# Altium project 555-Indicator.PrjPcb
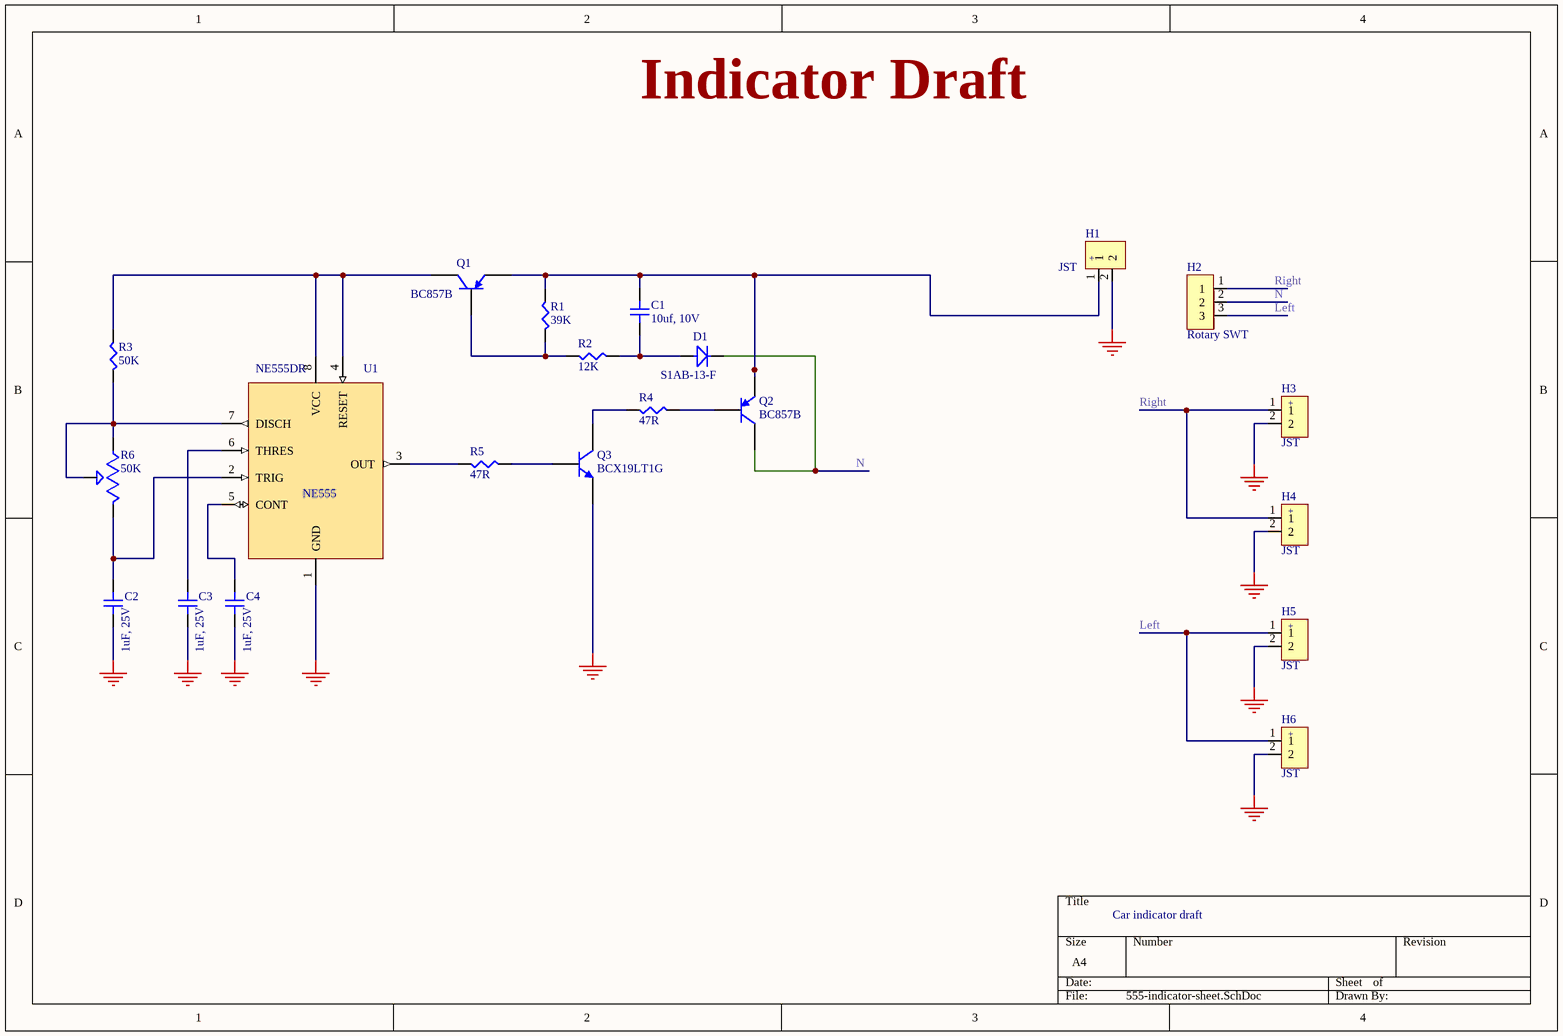
[diagram p0: 555-indicator-sheet.SchDoc]
1 sheet, 21 parts. Net scope: global (net labels, ports and power ports of the same name join across sheets).
Board file: 555-indicator-PCB.PcbDoc

## Sheet 555-indicator-sheet.SchDoc
size A4; SheetNumber: 1; SheetTotal: 1

### Parts
C1  10uf, 10V  [CAPC2012X140N]
C2  1uF, 25V  [CAPC2012X140N]
C3  1uF, 25V  [CAPC2012X140N]
C4  1uF, 25V  [CAPC2012X140N]
D1  S1AB-13-F  [FP-SMB-MFG]
H1  JST  [FP-B2B-XH-A_LF_SN-MFG]
H2  Rotary SWT  [JST_B3B-XH-A]
H3  JST  [FP-B2B-XH-A_LF_SN-MFG]
H4  JST  [FP-B2B-XH-A_LF_SN-MFG]
H5  JST  [FP-B2B-XH-A_LF_SN-MFG]
H6  JST  [FP-B2B-XH-A_LF_SN-MFG]
Q1  BC857B  [PNP_BC857B,235]
Q2  BC857B  [PNP_BC857B,235]
Q3  BCX19LT1G  [NPN_BCX19LT1G]
R1  39K  [RESC3116X65N]
R2  12K  [RESC3116X65N]
R3  50K  [RESC3116X65N]
R4  47R  [RESC3116X65N]
R5  47R  [RESC3116X65N]
R6  50K  [TRIM_3266W-1-503LF]
U1  NE555DR  [FP-D0008A-MFG]

### Nets
GND: C2.2 C3.2 C4.2 H1.2 H3.2 H4.2 H5.2 H6.2 Q3.2(E) U1.1(GND)
Left: H2.3 H5.1 H6.1
N: D1.2 H2.2 Q2.3(C)
Right: H2.1 H3.1 H4.1
NetC1_1: C1.1 D1.1 R2.2
NetC1_2: C1.2 H1.1 Q1.2(E) Q2.2(E) R1.1
NetC2_1: C2.1 R6.3(CW) U1.2(TRIG)
NetC3_1: C3.1 U1.6(THRES)
NetC4_1: C4.1 U1.5(CONT)
NetQ1_1: Q1.1(B) R1.2 R2.1
NetQ1_3: Q1.3(C) R3.1 U1.4(RESET) U1.8(VCC)
NetQ2_1: Q2.1(B) R4.2
NetQ3_1: Q3.1(B) R5.2
NetQ3_3: Q3.3(C) R4.1
NetR3_2: R3.2 R6.1(CCW) R6.2(WIPER) U1.7(DISCH)
NetR5_1: R5.1 U1.3(OUT)

### Notes on the sheet
- Indicator Draft
- Car indicator draft
- (in symbol B2B-XH-A(LF)(SN)) +
- (in symbol NE555DR) NE555

### Library data of the parts
C1 = CL21A106KPFNNNE: CAP CER 10UF 10V X5R 0805; Manufacturer: Samsung; Dielectric Material: Ceramic; Multilayer: Yes; Tolerance  (fill in as +-): 10%; Supplier: Digikey; Supplier Part Number: 1276-1052-6-ND; Manufacturer Part Number: CL21A106KPFNNNE; Category: Ceramic Capacitors; Stock: 539282; Pricing: 1=0.1, 10=0.054, 50=0.0374, 100=0.0322, 500=0.02334, 1000=0.0206 (USD); Mounting Technology: Surface Mount; Pins: 2; Package Shape: Rectangular; Case/Package: 0805; Terminal Finish: Nickel; Min Operating Temperature: -55°C; Max Operating Temperature: 85°C; JESD-609 Code: e3; Value: 10uF; Capacitor Type: Ceramic; Package Style: SMTMeter; Packaging: Tape and Reel; Tolerance (fill in as +-): 10%; Rated DC Voltage (URdc): 10V; Temperature Characteristics Code: X5R; Termination: Wraparound; Length: 2mm; Width: 1.25mm; Height: 1.35mm; Reach SVHC Compliant: Yes; RoHS Compliant: Yes; ComponentLink1URL: https://datasheet.ciiva.com:443/pdfs/VipMasterIC/IC/SEMS/SEMS-S-A0008526420/SEMS-S-A0008526398-1.pdf?src-supplier=IHS+Markit; ComponentLink1Description: https://datasheet.ciiva.com:443/pdfs/VipMasterIC/IC/SEMS/SEMS-S-A0008526420/SEMS-S-A0008526398-1.pdf?src-supplier=IHS+Markit; ComponentLink2URL: https://datasheet.ciiva.com/16199/cl05b104kq5nnnc-16199024.pdf?src-supplier=Future+Electronics; ComponentLink2Description: https://datasheet.ciiva.com/16199/cl05b104kq5nnnc-16199024.pdf?src-supplier=Future+Electronics; ComponentLink3URL: https://datasheet.ciiva.com/15195/getdatasheetpartid-357423-15195857.pdf?src-supplier=Verical; ComponentLink3Description: https://datasheet.ciiva.com/15195/getdatasheetpartid-357423-15195857.pdf?src-supplier=Verical; ComponentLink4URL: https://datasheet.octopart.com/CL21A106KPFNNNE-Samsung-Electro-Mechanics-datasheet-136031801.pdf?src-supplier=Farnell; ComponentLink4Description: https://datasheet.octopart.com/CL21A106KPFNNNE-Samsung-Electro-Mechanics-datasheet-136031801.pdf?src-supplier=Farnell; ComponentLink5URL: https://datasheet.octopart.com/CL21A106KPFNNNE-Samsung-Electro-Mechanics-datasheet-8324245.pdf; ComponentLink5Description: https://datasheet.octopart.com/CL21A106KPFNNNE-Samsung-Electro-Mechanics-datasheet-8324245.pdf; ComponentLink6URL: https://datasheet.octopart.com/CL21A106KPFNNNE-Samsung-Electro-Mechanics-datasheet-97040617.pdf; ComponentLink6Description: https://datasheet.octopart.com/CL21A106KPFNNNE-Samsung-Electro-Mechanics-datasheet-97040617.pdf; ComponentLink7URL: https://datasheet.octopart.com/General-Multilayer-Ceramic-Capacitors-Samsung-datasheet-family-111.pdf; ComponentLink7Description: https://datasheet.octopart.com/General-Multilayer-Ceramic-Capacitors-Samsung-datasheet-family-111.pdf; ComponentLink8URL: https://datasheet.octopart.com/CL21A106KPFNNNE-Samsung-Electro-Mechanics-datasheet-110326887.pdf?src-supplier=Future+Electronics; ComponentLink8Description: https://datasheet.octopart.com/CL21A106KPFNNNE-Samsung-Electro-Mechanics-datasheet-110326887.pdf?src-supplier=Future+Electronics; ComponentLink9URL: https://datasheet.octopart.com/CL21A106KPFNNNE-Samsung-Electro-Mechanics-datasheet-81462124.pdf?src-supplier=Future+Electronics; ComponentLink9Description: https://datasheet.octopart.com/CL21A106KPFNNNE-Samsung-Electro-Mechanics-datasheet-81462124.pdf?src-supplier=Future+Electronics; ComponentLink10URL: https://datasheet.octopart.com/CL21A106KPFNNNE-Samsung-datasheet-48647544.pdf?src-supplier=Future+Electronics; ComponentLink10Description: https://datasheet.octopart.com/CL21A106KPFNNNE-Samsung-datasheet-48647544.pdf?src-supplier=Future+Electronics; ComponentLink11URL: https://datasheet.octopart.com/CL21A106KPFNNNE-Samsung-datasheet-26669229.pdf?src-supplier=Future+Electronics; ComponentLink11Description: https://datasheet.octopart.com/CL21A106KPFNNNE-Samsung-datasheet-26669229.pdf?src-supplier=Future+Electronics; ComponentLink12URL: https://datasheet.octopart.com/CL21A106KPFNNNE-Samsung-datasheet-22147434.pdf?src-supplier=TME; ComponentLink12Description: https://datasheet.octopart.com/CL21A106KPFNNNE-Samsung-datasheet-22147434.pdf?src-supplier=TME; ComponentLink13URL: https://datasheet.octopart.com/CL21A106KPFNNNE-Samsung-Electro-Mechanics-datasheet-11781485.pdf?src-supplier=Arrow+Electronics; ComponentLink13Description: https://datasheet.octopart.com/CL21A106KPFNNNE-Samsung-Electro-Mechanics-datasheet-11781485.pdf?src-supplier=Arrow+Electronics; LCSC part no: C17024
C2-C4 = CL21B105KAFNNNE: CAP CER 1UF 25V X7R 0805; Manufacturer: Samsung; Dielectric Material: Ceramic; Multilayer: Yes; Tolerance  (fill in as +-): 10%; Supplier: Digikey; Supplier Part Number: 1276-1066-6-ND; Manufacturer Part Number: CL21B105KAFNNNE; RoHS: Yes; Category: Ceramic Capacitors; Stock: 1459194; Pricing: 1=0.08, 10=0.027, 50=0.022, 100=0.0168, 500=0.0152, 1000=0.0136 (USD); Mounting Technology: Surface Mount; Pins: 2; Package Shape: Rectangular; Case/Package: 0805; Terminal Finish: Nickel; Min Operating Temperature: -55°C; Max Operating Temperature: 125°C; JESD-609 Code: e3; Value: 1uF; Capacitor Type: Ceramic; Package Style: SMTMeter; Packaging: Tape and Reel; Tolerance (fill in as +-): 10%; Rated DC Voltage (URdc): 25V; Temperature Characteristics Code: X7R; Termination: Wraparound; Length: 2mm; Width: 1.25mm; Height: 1.35mm; Reach SVHC Compliant: Yes; RoHS Compliant: Yes; ComponentLink1URL: https://datasheet.ciiva.com:443/pdfs/VipMasterIC/IC/SEMS/SEMS-S-A0008523501/SEMS-S-A0008523563-1.pdf?src-supplier=IHS+Markit; ComponentLink1Description: https://datasheet.ciiva.com:443/pdfs/VipMasterIC/IC/SEMS/SEMS-S-A0008523501/SEMS-S-A0008523563-1.pdf?src-supplier=IHS+Markit; ComponentLink2URL: https://datasheet.ciiva.com/25800/cl21b105kafnnne-25800163.pdf?src-supplier=Digikey; ComponentLink2Description: https://datasheet.ciiva.com/25800/cl21b105kafnnne-25800163.pdf?src-supplier=Digikey; ComponentLink3URL: https://datasheet.ciiva.com/15195/getdatasheetpartid-355205-15195880.pdf?src-supplier=Verical; ComponentLink3Description: https://datasheet.ciiva.com/15195/getdatasheetpartid-355205-15195880.pdf?src-supplier=Verical; LCSC part no: C116352
D1 = S1AB-13-F: DIODE GEN PURP 50V 1A DO214AC; Manufacturer: Diodes; Package Body Material: Plastic; Diode Element Material: SILICON; Diode Type: RECTIFIER; Forward Voltage: 1.1V; Non-rep Pk Forward Current-Max: 30A; Number of Elements: 1; Reverse Recovery Time-Max: 3us; Time @ Peak Reflow Temperature-Max (s): 40s; Additional Feature: HIGH RELIABILITY; Qualification Status: Not Qualified; Supplier: Digikey; Supplier Part Number: S1AB-FDICT-ND; Manufacturer Part Number: S1AB-13-F; RoHS: Yes; Category: Rectifier Diodes; Stock: 182225; Pricing: 1=0.18, 10=0.121, 100=0.0813, 500=0.06208, 1000=0.05559 (USD); Pins: 2; Package Shape: Rectangular; Terminal Finish: Tin; Min Operating Temperature: -65°C; Max Operating Temperature: 150°C; Package Style: SMALL OUTLINEMeter; JESD-609 Code: e3; JESD-30 Code: R-PDSO-C2; Surface Mount: Yes; Terminal Form: C BEND; Terminal Position: DUAL; Moisture Sensitivity Level: 1; Max Output current: 1A; Peak Reflow Temperature (Cel): 260°C; Rep Pk Reverse Voltage-Max: 50V; RoHS Compliant: Yes; Reach SVHC Compliant: No; ComponentLink1URL: https://datasheet.ciiva.com:443/pdfs/VipMasterIC/IC/DIOD/DIOD-S-A0007810797/DIOD-S-A0007810797-1.pdf?src-supplier=IHS+Markit; ComponentLink1Description: https://datasheet.ciiva.com:443/pdfs/VipMasterIC/IC/DIOD/DIOD-S-A0007810797/DIOD-S-A0007810797-1.pdf?src-supplier=IHS+Markit; LCSC part no: C519094
H1 H3-H6 = B2B-XH-A(LF)(SN): CONN HEADER VERT 2POS 2.5MM; Supplier: Future Electronics; Supplier Part Number: 1638840; Manufacturer: JST; Manufacturer Part Number: B2B-XH-A(LF)(SN); RoHS: Yes; Category: Headers and Wire Housings; Stock: 668373; Pricing: 1=0.0563, 750=0.0541, 2500=0.0518, 7500=0.0498, 25000=0.0458 (USD); ComponentLink1URL: https://datasheet.ciiva.com/11746/0900766b8082653e-11746979.pdf?src-supplier=Rs; ComponentLink1Description: https://datasheet.ciiva.com/11746/0900766b8082653e-11746979.pdf?src-supplier=Rs; ComponentLink2URL: https://datasheet.ciiva.com/26894/getdatasheetpartid-640357-26894434.pdf?src-supplier=Verical; ComponentLink2Description: https://datasheet.ciiva.com/26894/getdatasheetpartid-640357-26894434.pdf?src-supplier=Verical; ComponentLink3URL: https://datasheet.ciiva.com/26894/getdatasheetpartid-385291-26894760.pdf?src-supplier=Verical; ComponentLink3Description: https://datasheet.ciiva.com/26894/getdatasheetpartid-385291-26894760.pdf?src-supplier=Verical; ComponentLink4URL: https://datasheet.ciiva.com/8052/5448-8052024.pdf?src-supplier=Element14; ComponentLink4Description: https://datasheet.ciiva.com/8052/5448-8052024.pdf?src-supplier=Element14; LCSC part no: C158012
H2 = B3B-XH-A(LF)(SN): CONN HEADER VERT 3POS 2.5MM; Manufacturer: JST; Supplier: Future Electronics; Supplier Part Number: 8262735; Manufacturer Part Number: B3B-XH-A(LF)(SN); RoHS: Yes; Category: Headers and Wire Housings; Stock: 57931; Pricing: 1=0.0792, 500=0.0757, 1500=0.0727, 5000=0.0695, 15000=0.0637 (USD); ComponentLink1URL: https://datasheet.ciiva.com/11746/0900766b8082653f-11746520.pdf?src-supplier=Rs; ComponentLink1Description: https://datasheet.ciiva.com/11746/0900766b8082653f-11746520.pdf?src-supplier=Rs; ComponentLink2URL: https://datasheet.ciiva.com/26894/getdatasheetpartid-640434-26894454.pdf?src-supplier=Verical; ComponentLink2Description: https://datasheet.ciiva.com/26894/getdatasheetpartid-640434-26894454.pdf?src-supplier=Verical; ComponentLink3URL: https://datasheet.ciiva.com/26894/getdatasheetpartid-440399-26894778.pdf?src-supplier=Verical; ComponentLink3Description: https://datasheet.ciiva.com/26894/getdatasheetpartid-440399-26894778.pdf?src-supplier=Verical; LCSC part no: C144394
Q1 Q2 = BC857B: BJT SOT-23 45V 100MA; Manufacturer: Infineon; Supplier: Digikey; Supplier Part Number: BC857BE6327HTSA1CT-ND; Manufacturer Part Number: BC857B; RoHS: Yes; Stock: 18586; Pricing: 1=0.23, 10=0.14, 100=0.0872, 500=0.06382, 1000=0.05625 (USD); LCSC part no: C181146
Q3 = BCX19LT1G: TRANS NPN 45V 0.5A SOT23-3; Manufacturer: ON Semiconductor; Package Body Material: Plastic; Transistor Element Material: SILICON; Max Collector Current: 500mA; DC Current Gain-Min (hFE): 40; Number of Elements: 1; Time @ Peak Reflow Temperature-Max (s): 40s; Power Dissipation-Max (Abs): 225mW; Qualification Status: Not Qualified; JEDEC-95 Code: TO-236AB; Supplier: Digikey; Supplier Part Number: BCX19LT1GOSCT-ND; Manufacturer Part Number: BCX19LT1G; RoHS: Yes; Category: BJTs; Stock: 4512; Pricing: 1=0.12, 10=0.085, 100=0.0569, 500=0.04318, 1000=0.03851 (USD); Pins: 3; Package Shape: Rectangular; Terminal Finish: Tin; Max Operating Temperature: 150°C; Polarity/Channel Type: NPN; Moisture Sensitivity Level: 1; Surface Mount: Yes; JESD-609 Code: e3; Collector-emitter Voltage-Max: 45V; JESD-30 Code: R-PDSO-G3; Package Style: SMALL OUTLINEMeter; Terminal Form: Gull Wing; Terminal Position: DUAL; Peak Reflow Temperature (Cel): 260°C; RoHS Compliant: Yes; Reach SVHC Compliant: Yes; ComponentLink1URL: https://datasheet.ciiva.com:443/pdfs/VipMasterIC/IC/ONSM/ONSMS38866/ONSMS38866-1.pdf?src-supplier=IHS+Markit; ComponentLink1Description: https://datasheet.ciiva.com:443/pdfs/VipMasterIC/IC/ONSM/ONSMS38866/ONSMS38866-1.pdf?src-supplier=IHS+Markit; ComponentLink2URL: https://datasheet.ciiva.com/15138/getdatasheetpartid-38785-15138642.pdf?src-supplier=Verical; ComponentLink2Description: https://datasheet.ciiva.com/15138/getdatasheetpartid-38785-15138642.pdf?src-supplier=Verical; ComponentLink3URL: https://datasheet.ciiva.com/976/bcx17lt1-d-976538.pdf?src-supplier=Digikey; ComponentLink3Description: https://datasheet.ciiva.com/976/bcx17lt1-d-976538.pdf?src-supplier=Digikey; ComponentLink4URL: https://datasheet.ciiva.com/976/bcx17lt1-d-976539.pdf?src-supplier=Digikey; ComponentLink4Description: https://datasheet.ciiva.com/976/bcx17lt1-d-976539.pdf?src-supplier=Digikey; ComponentLink5URL: https://datasheet.ciiva.com/976/bcx17lt1-d-976540.pdf?src-supplier=Digikey; ComponentLink5Description: https://datasheet.ciiva.com/976/bcx17lt1-d-976540.pdf?src-supplier=Digikey; ComponentLink6URL: https://datasheet.ciiva.com/11204/bcx17lt1-d-11204428.pdf?src-supplier=Avnet; ComponentLink6Description: https://datasheet.ciiva.com/11204/bcx17lt1-d-11204428.pdf?src-supplier=Avnet; LCSC part no: C232541
R1 = ERJ-PB6B3902V: Res SMD 39K Ohm 0.1% 1/4W 0805; Manufacturer: Panasonic; Supplier: Digikey; Supplier Part Number: P20774CT-ND; Manufacturer Part Number: ERJ-PB6B3902V; RoHS: Yes; Category: Chip SMD Resistors; Stock: 9918; Pricing: 1=0.29, 10=0.161, 25=0.1292, 50=0.1098, 100=0.0939, 250=0.07684, 500=0.06644, 1000=0.05775 (USD); ComponentLink1URL: http://datasheet.octopart.com/ERJPB6B3902V-Panasonic-datasheet-82522998.pdf?src-supplier=Farnell; ComponentLink1Description: http://datasheet.octopart.com/ERJPB6B3902V-Panasonic-datasheet-82522998.pdf?src-supplier=Farnell; ComponentLink2URL: https://datasheet.octopart.com/ERJ-PB6B3902V-Panasonic-datasheet-82522998.pdf?src-supplier=Newark; ComponentLink2Description: https://datasheet.octopart.com/ERJ-PB6B3902V-Panasonic-datasheet-82522998.pdf?src-supplier=Newark; ComponentLink3URL: http://datasheet.octopart.com/ERJPB6B3902V-Panasonic-datasheet-82522998.pdf?src-supplier=Verical; ComponentLink3Description: http://datasheet.octopart.com/ERJPB6B3902V-Panasonic-datasheet-82522998.pdf?src-supplier=Verical; ComponentLink4URL: https://industrial.panasonic.com/cdbs/www-data/pdf/RDM0000/AOA0000C328.pdf?src-supplier=Digikey; ComponentLink4Description: https://industrial.panasonic.com/cdbs/www-data/pdf/RDM0000/AOA0000C328.pdf?src-supplier=Digikey; LCSC part no: C4158317
R2 = ERJPB6B1202V: RES SMD 12K OHM 0.1% 1/4W 0805; Manufacturer: Panasonic; Power: 250mW; Rated Temperature: 70°C; Value: 12kR; Temperature Coefficient: 50ppm/°C; Working Voltage: 150V; Package Height: 0.6mm; Package Length: 2mm; Package Width: 1.25mm; Reference Standard: AEC-Q200; Supplier: Digikey; Supplier Part Number: P20716CT-ND; Manufacturer Part Number: ERJPB6B1202V; Category: Chip SMD Resistors; Stock: 15534; Pricing: 1=0.29, 10=0.161, 25=0.1292, 50=0.1098, 100=0.0939, 250=0.07684, 500=0.06644, 1000=0.05775 (USD); Mounting Technology: Surface Mount; Pins: 2; Case/Package: 0805; Min Operating Temperature: -55°C; Max Operating Temperature: 155°C; Tolerance: 0.1%; Resistor Type: FIXED RESISTOR; Construction: Rectangular; Packaging: Tape and Reel; Technology: METAL GLAZE/THICK FILM; Termination: Wraparound; Reach SVHC Compliant: Yes; RoHS Compliant: Yes; ComponentLink1URL: https://datasheet.ciiva.com:443/pdfs/VipMasterIC/IC/PANA/PANA-S-A0009891633/PANA-S-A0009891633-1.pdf?src-supplier=IHS+Markit; ComponentLink1Description: https://datasheet.ciiva.com:443/pdfs/VipMasterIC/IC/PANA/PANA-S-A0009891633/PANA-S-A0009891633-1.pdf?src-supplier=IHS+Markit; ComponentLink2URL: https://datasheet.octopart.com/ERJPB6B1202V-Panasonic-datasheet-82522998.pdf?src-supplier=Newark; ComponentLink2Description: https://datasheet.octopart.com/ERJPB6B1202V-Panasonic-datasheet-82522998.pdf?src-supplier=Newark; ComponentLink3URL: https://industrial.panasonic.com/cdbs/www-data/pdf/RDM0000/AOA0000C328.pdf?src-supplier=Digikey; ComponentLink3Description: https://industrial.panasonic.com/cdbs/www-data/pdf/RDM0000/AOA0000C328.pdf?src-supplier=Digikey; ComponentLink4URL: https://datasheet.octopart.com/ERJPB6B1202V-Panasonic-datasheet-136610817.pdf?src-supplier=Newark; ComponentLink4Description: https://datasheet.octopart.com/ERJPB6B1202V-Panasonic-datasheet-136610817.pdf?src-supplier=Newark; ComponentLink5URL: https://datasheet.octopart.com/ERJPB6B1202V-Panasonic-datasheet-177212511.pdf?src-supplier=Burklin+Elektronik; ComponentLink5Description: https://datasheet.octopart.com/ERJPB6B1202V-Panasonic-datasheet-177212511.pdf?src-supplier=Burklin+Elektronik; LCSC part no: C413717
R3 = RT1206BRD0750KL: RES SMD 50K OHM 0.1% 1/4W 1206; Manufacturer: Yageo; Additional Feature: LASER TRIMMABLE; Power: 250mW; Rated Temperature: 70°C; Value: 50kR; Temperature Coefficient: 25ppm/°C; Working Voltage: 200V; Supplier: Digikey; Supplier Part Number: 13-RT1206BRD0750KLCT-ND; Manufacturer Part Number: RT1206BRD0750KL; RoHS: Yes; Category: Chip SMD Resistors; Stock: 21777; Pricing: 1=0.34, 10=0.246, 50=0.1908, 100=0.1693, 500=0.1275, 1000=0.1122 (USD); Mounting Technology: Surface Mount; Pins: 2; Package Shape: Rectangular; Case/Package: 1206; Min Operating Temperature: -55°C; Max Operating Temperature: 155°C; Tolerance: 0.1%; Resistor Type: FIXED RESISTOR; Packaging: Tape and Reel; Technology: THIN FILM; Termination: Wraparound; Reach SVHC Compliant: Yes; RoHS Compliant: Yes; ComponentLink1URL: https://datasheet.ciiva.com:443/pdfs/VipMasterIC/IC/YAGO/YAGO-S-A0003507815/YAGO-S-A0003507815-1.pdf?src-supplier=IHS+Markit; ComponentLink1Description: https://datasheet.ciiva.com:443/pdfs/VipMasterIC/IC/YAGO/YAGO-S-A0003507815/YAGO-S-A0003507815-1.pdf?src-supplier=IHS+Markit; ComponentLink2URL: https://datasheet.octopart.com/RT1206BRD0750KL-Yageo-datasheet-166250672.pdf?src-supplier=Future+Electronics; ComponentLink2Description: https://datasheet.octopart.com/RT1206BRD0750KL-Yageo-datasheet-166250672.pdf?src-supplier=Future+Electronics; ComponentLink3URL: http://www.yageo.com/documents/recent/PYu-RT_1-to-0.01_RoHS_L_8.pdf?src-supplier=Digikey; ComponentLink3Description: http://www.yageo.com/documents/recent/PYu-RT_1-to-0.01_RoHS_L_8.pdf?src-supplier=Digikey; LCSC part no: C706417
R4 R5 = RPC0805JT47R0: RES 47 OHM 5% 1/4W 0805; Manufacturer: Stackpole Electronics; LCS part no: C5869749; Power: 250mW; Rated Temperature: 70°C; Temperature Coefficient: 200ppm/°C; Working Voltage: 150V; Package Height: 0.5mm; Package Length: 2mm; Package Width: 1.25mm; Reference Standard: AEC-Q200; Supplier: Digikey; Supplier Part Number: RPC0805JT47R0DKR-ND; Manufacturer Part Number: RPC0805JT47R0; RoHS: Yes; Category: Chip SMD Resistors; Stock: 55267; Pricing: 1=0.17, 10=0.087, 50=0.058, 100=0.0494, 500=0.03554, 1000=0.03137 (USD); Mounting Technology: Surface Mount; Pins: 2; Package Shape: Rectangular; Case/Package: 0805; Terminal Finish: Nickel; Min Operating Temperature: -55°C; Max Operating Temperature: 155°C; Tolerance: 5%; JESD-609 Code: e3; Resistor Type: FIXED RESISTOR; Construction: Rectangular; Packaging: Tape and Reel; Value: 47R; Technology: METAL GLAZE/THICK FILM; Termination: Wraparound; Reach SVHC Compliant: Yes; RoHS Compliant: Yes; ComponentLink1URL: https://datasheet.ciiva.com:443/pdfs/VipMasterIC/IC/SEIE/SEIE-S-A0010122904/SEIE-S-A0010122904-1.pdf?src-supplier=IHS+Markit; ComponentLink1Description: https://datasheet.ciiva.com:443/pdfs/VipMasterIC/IC/SEIE/SEIE-S-A0010122904/SEIE-S-A0010122904-1.pdf?src-supplier=IHS+Markit; ComponentLink2URL: https://www.seielect.com/Catalog/SEI-rpc.pdf?src-supplier=Digikey; ComponentLink2Description: https://www.seielect.com/Catalog/SEI-rpc.pdf?src-supplier=Digikey; ComponentLink3URL: https://www.seielect.com/catalog/SEI-Packaging.pdf?src-supplier=Digikey; ComponentLink3Description: https://www.seielect.com/catalog/SEI-Packaging.pdf?src-supplier=Digikey; LCSC part no: C5869749
R6 = 3266W-1-503LF (2): 50K OHM 0.25W PC PIN TOP; Manufacturer: Bourns; Tolerance: 10%; Actuator Orientation: Vertical; Actuator Type: SCREW; Number of Turns: 12; Power: 250mW; Rated Temperature: 70°C; Value: 50kR; Resistance Law: Linear; Rotational Angle: 4320°; Temperature Coefficient: -100100ppm/°C; Lead Diameter: 0.46mm; Lead Length: 4.88mm; Package Height: 6.85mm; Package Length: 6.71mm; Package Width: 4.5mm; Description: Trimmer, Cermet, 0.25W, 50000ohm, 300V, 10% +/-Tol, 100ppm/Cel, 12 Turn(s); Supplier: Digikey; Supplier Part Number: 3266W-503LF-ND; Manufacturer Part Number: 3266W-1-503LF; RoHS: Yes; Category: Variable Resistors and Potentiometers; Stock: 1328; Pricing: 1=4.17, 10=3.35, 25=3.0676, 50=2.869, 100=2.6824, 250=2.45264, 500=2.29082, 1000=2.13862, 5000=1.81904 (USD); Mounting Technology: Through Hole; Pins: 3; Package Shape: Rectangular; Case/Package: 2618; Terminal Finish: Tin; Min Operating Temperature: -55°C; Max Operating Temperature: 150°C; JESD-609 Code: e3; Resistor Type: TRIMMER; Construction: Trimmer Pot; Packaging: Rail/Tube; Technology: CERMET; Termination: Wire; RoHS Compliant: Yes; Reach SVHC Compliant: No; ComponentLink1URL: https://datasheet.ciiva.com:443/pdfs/VipMasterIC/IC/BOUR/BOUR-S-A0008901203/BOUR-S-A0008901203-1.pdf?src-supplier=IHS+Markit; ComponentLink1Description: https://datasheet.ciiva.com:443/pdfs/VipMasterIC/IC/BOUR/BOUR-S-A0008901203/BOUR-S-A0008901203-1.pdf?src-supplier=IHS+Markit; ComponentLink2URL: https://datasheet.ciiva.com/29122/447254-da-01-en-trimmer-tht-3266w-1-503lf-50k-0-25w-29122338.pdf?src-supplier=Conrad; ComponentLink2Description: https://datasheet.ciiva.com/29122/447254-da-01-en-trimmer-tht-3266w-1-503lf-50k-0-25w-29122338.pdf?src-supplier=Conrad; ComponentLink3URL: https://datasheet.ciiva.com/2156/3266-2156991.pdf?src-supplier=Digikey; ComponentLink3Description: https://datasheet.ciiva.com/2156/3266-2156991.pdf?src-supplier=Digikey; LCSC part no: C780226
U1 = NE555DR: IC OSC SGL TIMER 100KHZ 8-SOIC; Manufacturer: Texas Instruments; Package Body Material: Plastic; Throw Configuration: PULSE; RECTANGULAR; Channels: 1; Package Equivalence Code: SOP8,.25; Power Supplies: 5/15V; Max Supply Voltage: 16V; Min Supply Voltage: 4.5V; Nominal Supply Voltage: 5V; Qualification Status: Not Qualified; Supplier: Digikey; Supplier Part Number: 296-6501-1-ND; Manufacturer Part Number: NE555DR; RoHS: Yes; Category: Timers and Oscillators; Stock: 55657; Pricing: 1=0.2, 10=0.136, 25=0.1196, 100=0.1018, 250=0.0934, 500=0.08832, 1000=0.08413 (USD); Case/Package: SOP; Pins: 8; Package Shape: Rectangular; Terminal Finish: Tin; Min Operating Temperature: 0°C; Max Operating Temperature: 70°C; JESD-609 Code: e3; JESD-30 Code: R-PDSO-G8; Moisture Sensitivity Level: 1; Package Style: SMALL OUTLINEMeter; Peak Reflow Temperature (Cel): 260°C; Surface Mount: Yes; Technology: BIPOLAR; Terminal Form: Gull Wing; Terminal Position: DUAL; Length: 4.9mm; Width: 3.9mm; Height - Seated (Max): 1.75mm; Terminal Pitch: 1.27mm; Reach SVHC Compliant: Yes; RoHS Compliant: Yes; Temperature Grade: COMMERCIAL; ComponentLink1URL: https://www.ti.com:443/lit/ds/symlink/na555.pdf?src-supplier=IHS+Markit; ComponentLink1Description: https://www.ti.com:443/lit/ds/symlink/na555.pdf?src-supplier=IHS+Markit; ComponentLink2URL: https://datasheet.ciiva.com/1233/ne555-1233132.pdf?src-supplier=Digikey; ComponentLink2Description: https://datasheet.ciiva.com/1233/ne555-1233132.pdf?src-supplier=Digikey; ComponentLink3URL: https://datasheet.ciiva.com/1233/ne555-1233131.pdf?src-supplier=Digikey; ComponentLink3Description: https://datasheet.ciiva.com/1233/ne555-1233131.pdf?src-supplier=Digikey; ComponentLink4URL: https://datasheet.ciiva.com/1139/1874740-1139901.pdf?src-supplier=Element14; ComponentLink4Description: https://datasheet.ciiva.com/1139/1874740-1139901.pdf?src-supplier=Element14; ComponentLink5URL: https://datasheet.ciiva.com/1233/ne555-1233133.pdf?src-supplier=Digikey; ComponentLink5Description: https://datasheet.ciiva.com/1233/ne555-1233133.pdf?src-supplier=Digikey; ComponentLink6URL: https://datasheet.ciiva.com/46395/1874740-46395978.pdf?src-supplier=Element14; ComponentLink6Description: https://datasheet.ciiva.com/46395/1874740-46395978.pdf?src-supplier=Element14; LCSC part no: C7593